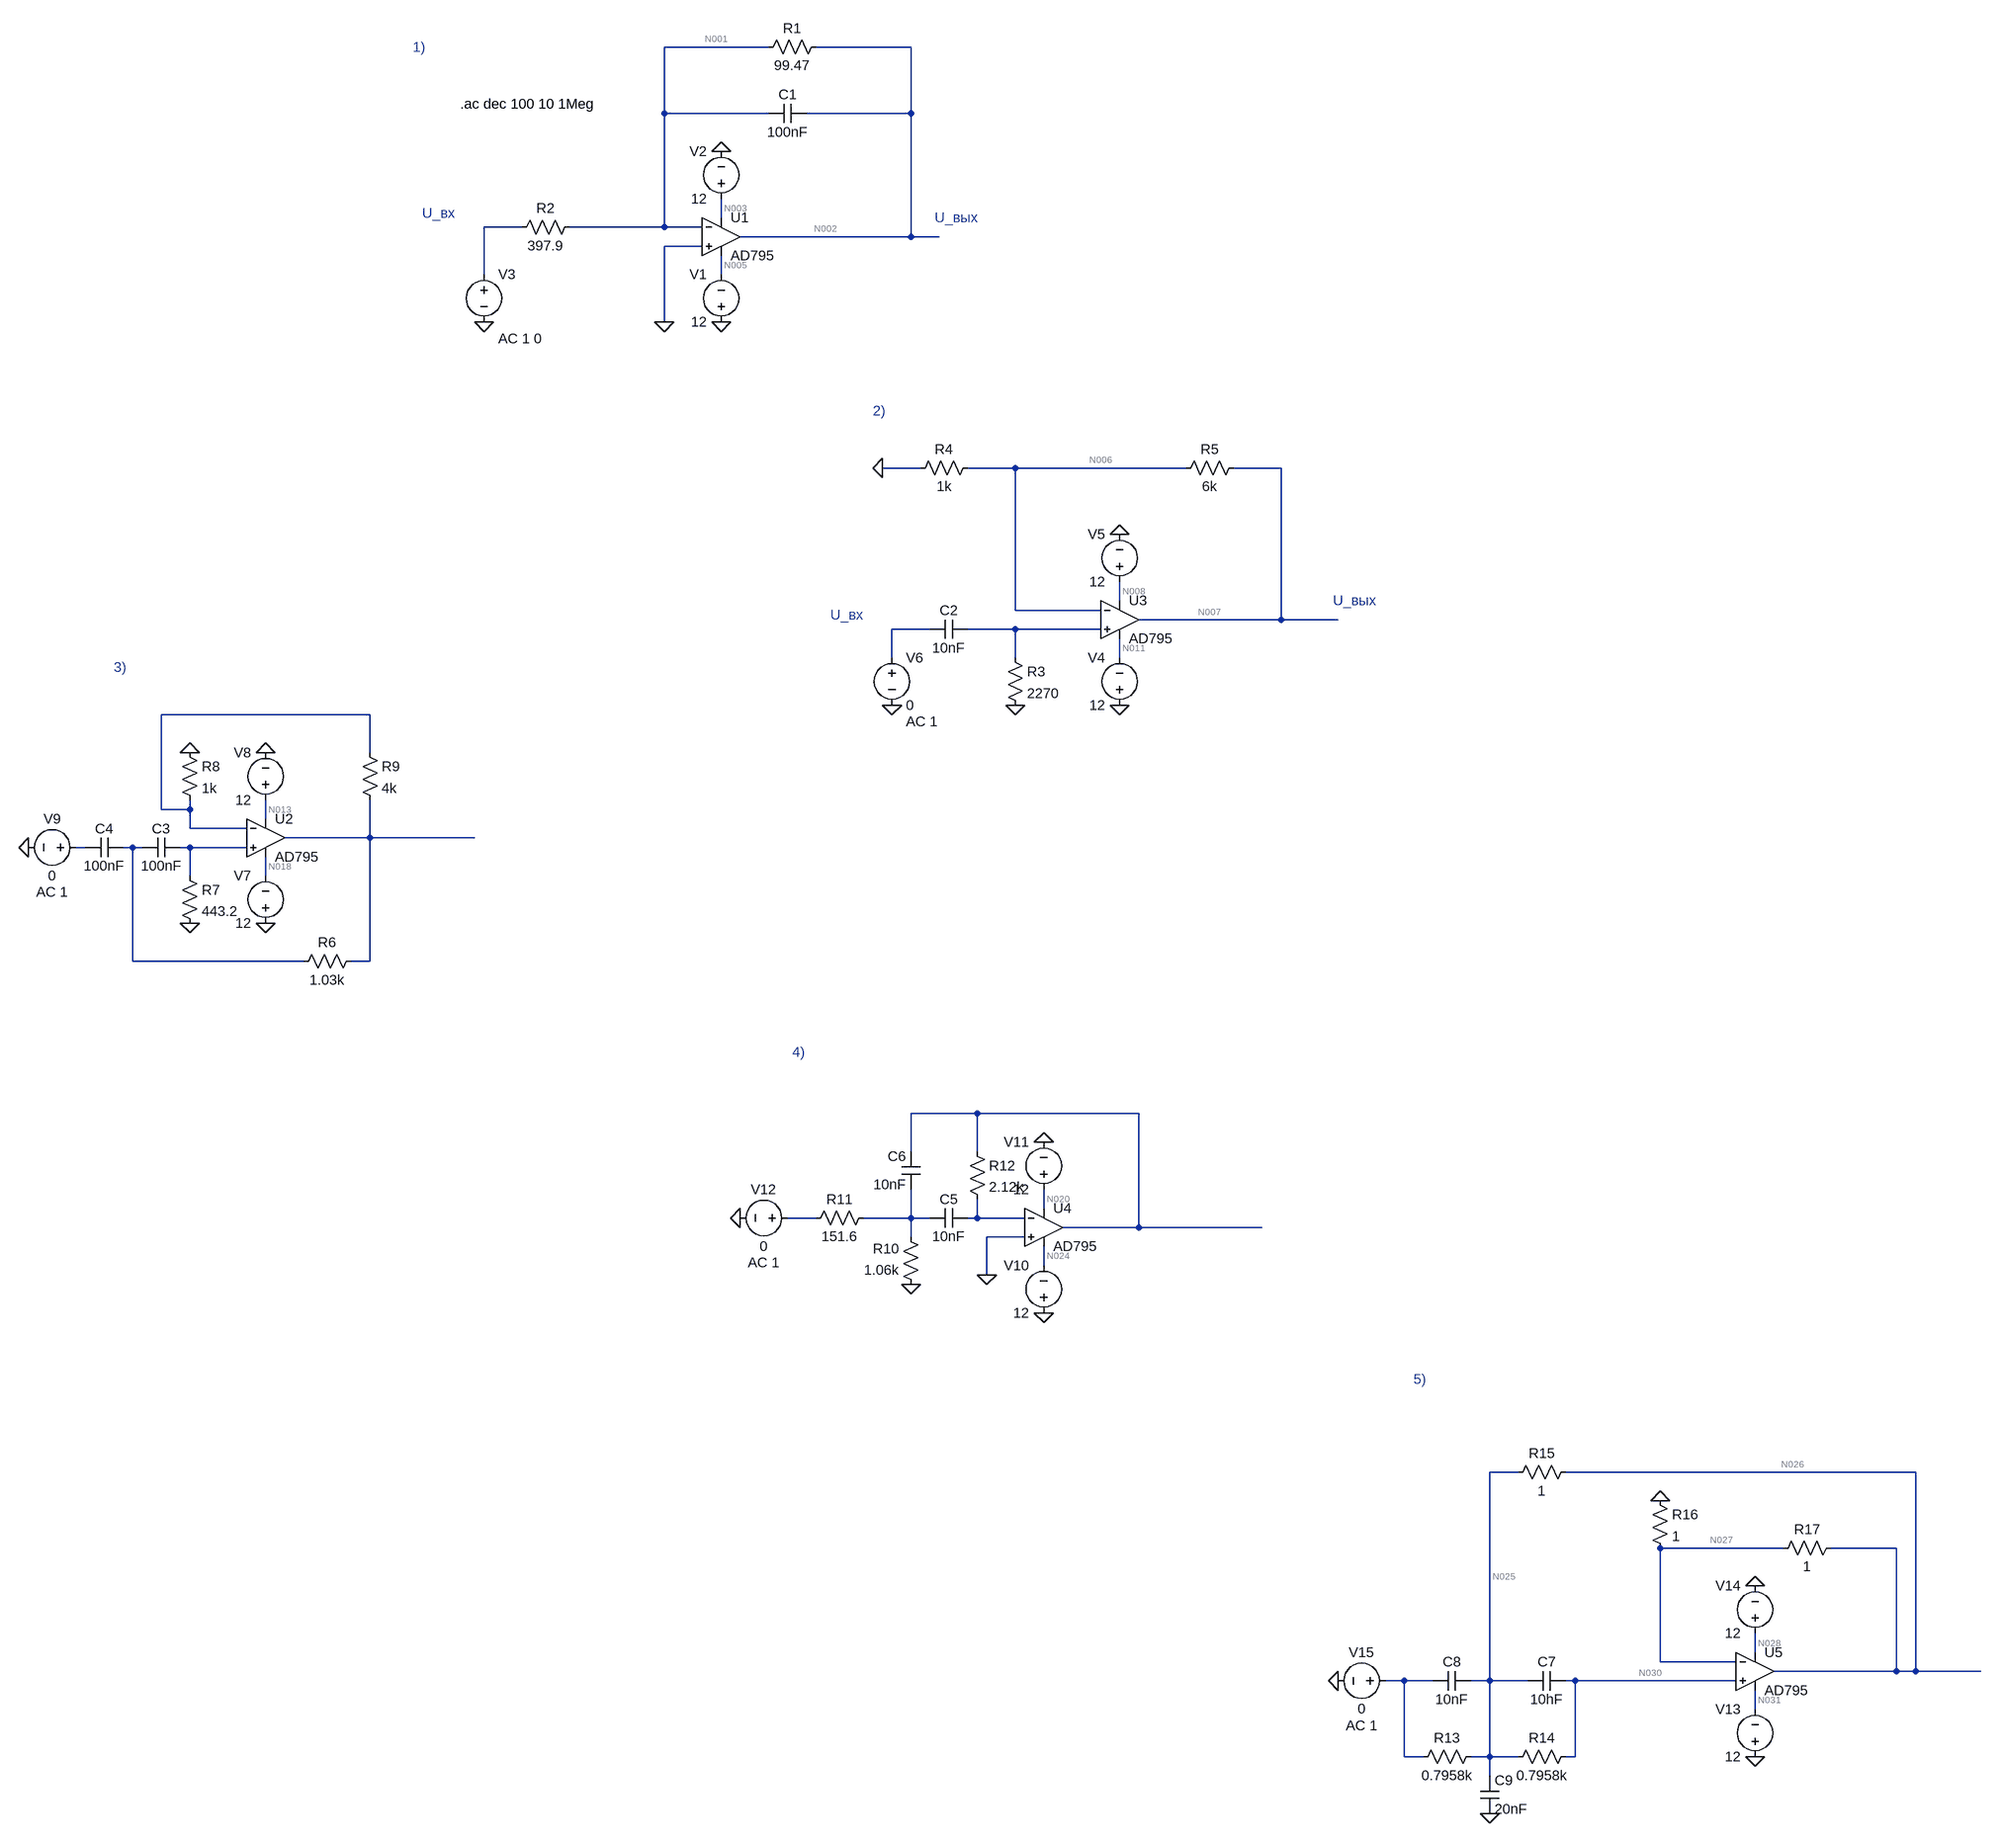
[diagram p0: schematic all.asc]
all.asc, the LTspice schematic file:
Version 4.1
SHEET 1 2724 3428
WIRE 352 -160 176 -160
WIRE 592 -160 432 -160
WIRE 176 -48 176 -160
WIRE 352 -48 176 -48
WIRE 592 -48 592 -160
WIRE 592 -48 416 -48
WIRE 272 128 272 96
WIRE -64 144 -128 144
WIRE 176 144 176 -48
WIRE 176 144 16 144
WIRE 240 144 176 144
WIRE 592 160 592 -48
WIRE 592 160 304 160
WIRE 640 160 592 160
WIRE 240 176 176 176
WIRE -128 224 -128 144
WIRE 272 224 272 192
WIRE 176 304 176 176
WIRE 608 640 544 640
WIRE 768 640 688 640
WIRE 1056 640 768 640
WIRE 1216 640 1136 640
WIRE 944 864 944 832
WIRE 768 880 768 640
WIRE 912 880 768 880
WIRE 1216 896 1216 640
WIRE 1216 896 976 896
WIRE 1312 896 1216 896
WIRE 624 912 560 912
WIRE 768 912 688 912
WIRE 912 912 768 912
WIRE 560 960 560 912
WIRE 768 960 768 912
WIRE 944 960 944 928
WIRE -320 1056 -672 1056
WIRE -320 1120 -320 1056
WIRE -672 1216 -672 1056
WIRE -624 1216 -624 1200
WIRE -624 1216 -672 1216
WIRE -496 1232 -496 1200
WIRE -624 1248 -624 1216
WIRE -528 1248 -624 1248
WIRE -320 1264 -320 1200
WIRE -320 1264 -464 1264
WIRE -144 1264 -320 1264
WIRE -800 1280 -816 1280
WIRE -720 1280 -736 1280
WIRE -704 1280 -720 1280
WIRE -624 1280 -640 1280
WIRE -528 1280 -624 1280
WIRE -624 1328 -624 1280
WIRE -496 1328 -496 1296
WIRE -720 1472 -720 1280
WIRE -432 1472 -720 1472
WIRE -320 1472 -320 1264
WIRE -320 1472 -352 1472
WIRE 704 2224 592 2224
WIRE 976 2224 704 2224
WIRE 592 2288 592 2224
WIRE 704 2288 704 2224
WIRE 816 2384 816 2352
WIRE 432 2400 384 2400
WIRE 592 2400 592 2352
WIRE 592 2400 512 2400
WIRE 624 2400 592 2400
WIRE 704 2400 704 2368
WIRE 704 2400 688 2400
WIRE 784 2400 704 2400
WIRE 976 2416 976 2224
WIRE 976 2416 848 2416
WIRE 1184 2416 976 2416
WIRE 592 2432 592 2400
WIRE 784 2432 720 2432
WIRE 816 2480 816 2448
WIRE 720 2496 720 2432
WIRE 1616 2832 1568 2832
WIRE 2496 2832 1696 2832
WIRE 2080 2960 1872 2960
WIRE 2464 2960 2160 2960
WIRE 2032 3136 2032 3104
WIRE 1872 3152 1872 2960
WIRE 2000 3152 1872 3152
WIRE 2464 3168 2464 2960
WIRE 2464 3168 2064 3168
WIRE 2496 3168 2496 2832
WIRE 2496 3168 2464 3168
WIRE 2720 3168 2496 3168
WIRE 1424 3184 1392 3184
WIRE 1472 3184 1424 3184
WIRE 1568 3184 1568 2832
WIRE 1568 3184 1536 3184
WIRE 1632 3184 1568 3184
WIRE 1712 3184 1696 3184
WIRE 2000 3184 1712 3184
WIRE 2032 3232 2032 3200
WIRE 1424 3312 1424 3184
WIRE 1456 3312 1424 3312
WIRE 1568 3312 1568 3184
WIRE 1568 3312 1536 3312
WIRE 1616 3312 1568 3312
WIRE 1712 3312 1712 3184
WIRE 1712 3312 1696 3312
WIRE 1568 3344 1568 3312
FLAG 272 16 0
FLAG 272 304 0
FLAG 176 304 0
FLAG -128 304 0
FLAG 944 752 0
FLAG 944 1040 0
FLAG 768 1040 0
FLAG 560 1040 0
FLAG 544 640 0
FLAG -496 1120 0
FLAG -496 1408 0
FLAG -896 1280 0
FLAG -624 1408 0
FLAG -624 1120 0
FLAG 720 2496 0
FLAG 816 2272 0
FLAG 816 2560 0
FLAG 592 2512 0
FLAG 304 2400 0
FLAG 2032 3024 0
FLAG 2032 3312 0
FLAG 1568 3408 0
FLAG 1872 2880 0
FLAG 1312 3184 0
SYMBOL OpAmps\\AD795 272 96 R0
SYMATTR InstName U1
SYMBOL voltage 272 320 R180
WINDOW 0 24 96 Left 2
WINDOW 3 24 16 Left 2
SYMATTR InstName V1
SYMATTR Value 12
SYMBOL voltage 272 112 R180
WINDOW 0 24 96 Left 2
WINDOW 3 24 16 Left 2
SYMATTR InstName V2
SYMATTR Value 12
SYMBOL res 448 -176 R90
WINDOW 0 0 56 VBottom 2
WINDOW 3 32 56 VTop 2
SYMATTR InstName R1
SYMATTR Value 99.47
SYMBOL res 32 128 R90
WINDOW 0 0 56 VBottom 2
WINDOW 3 32 56 VTop 2
SYMATTR InstName R2
SYMATTR Value 397.9
SYMBOL cap 416 -64 R90
WINDOW 0 0 32 VBottom 2
WINDOW 3 32 32 VTop 2
SYMATTR InstName C1
SYMATTR Value 100nF
SYMBOL OpAmps\\AD795 944 832 R0
SYMATTR InstName U3
SYMBOL voltage 944 1056 R180
WINDOW 0 24 96 Left 2
WINDOW 3 24 16 Left 2
SYMATTR InstName V4
SYMATTR Value 12
SYMBOL voltage 944 848 R180
WINDOW 0 24 96 Left 2
WINDOW 3 24 16 Left 2
SYMATTR InstName V5
SYMATTR Value 12
SYMBOL res 704 624 R90
WINDOW 0 0 56 VBottom 2
WINDOW 3 32 56 VTop 2
SYMATTR InstName R4
SYMATTR Value 1k
SYMBOL res 1152 624 R90
WINDOW 0 0 56 VBottom 2
WINDOW 3 32 56 VTop 2
SYMATTR InstName R5
SYMATTR Value 6k
SYMBOL cap 688 896 R90
WINDOW 0 0 32 VBottom 2
WINDOW 3 32 32 VTop 2
SYMATTR InstName C2
SYMATTR Value 10nF
SYMBOL voltage 560 944 R0
WINDOW 123 24 124 Left 2
WINDOW 39 0 0 Left 0
SYMATTR Value2 AC 1
SYMATTR InstName V6
SYMATTR Value 0
SYMBOL res 752 944 R0
SYMATTR InstName R3
SYMATTR Value 2270
SYMBOL OpAmps\\AD795 -496 1200 R0
SYMATTR InstName U2
SYMBOL voltage -496 1424 R180
WINDOW 0 24 96 Left 2
WINDOW 3 24 16 Left 2
SYMATTR InstName V7
SYMATTR Value 12
SYMBOL voltage -496 1216 R180
WINDOW 0 24 96 Left 2
WINDOW 3 24 16 Left 2
SYMATTR InstName V8
SYMATTR Value 12
SYMBOL cap -640 1264 R90
WINDOW 0 0 32 VBottom 2
WINDOW 3 32 32 VTop 2
SYMATTR InstName C3
SYMATTR Value 100nF
SYMBOL cap -736 1264 R90
WINDOW 0 0 32 VBottom 2
WINDOW 3 32 32 VTop 2
SYMATTR InstName C4
SYMATTR Value 100nF
SYMBOL voltage -800 1280 R90
WINDOW 0 -32 56 VBottom 2
WINDOW 3 32 56 VTop 2
WINDOW 123 60 56 VTop 2
WINDOW 39 0 0 Left 0
SYMATTR InstName V9
SYMATTR Value 0
SYMATTR Value2 AC 1
SYMBOL res -336 1456 R90
WINDOW 0 0 56 VBottom 2
WINDOW 3 32 56 VTop 2
SYMATTR InstName R6
SYMATTR Value 1.03k
SYMBOL res -640 1312 R0
SYMATTR InstName R7
SYMATTR Value 443.2
SYMBOL res -640 1104 R0
SYMATTR InstName R8
SYMATTR Value 1k
SYMBOL res -336 1104 R0
SYMATTR InstName R9
SYMATTR Value 4k
SYMBOL OpAmps\\AD795 816 2352 R0
SYMATTR InstName U4
SYMBOL voltage 816 2576 R180
WINDOW 0 24 96 Left 2
WINDOW 3 24 16 Left 2
SYMATTR InstName V10
SYMATTR Value 12
SYMBOL voltage 816 2368 R180
WINDOW 0 24 96 Left 2
WINDOW 3 24 16 Left 2
SYMATTR InstName V11
SYMATTR Value 12
SYMBOL cap 688 2384 R90
WINDOW 0 0 32 VBottom 2
WINDOW 3 32 32 VTop 2
SYMATTR InstName C5
SYMATTR Value 10nF
SYMBOL res 608 2528 R180
WINDOW 0 36 76 Left 2
WINDOW 3 36 40 Left 2
SYMATTR InstName R10
SYMATTR Value 1.06k
SYMBOL res 528 2384 R90
WINDOW 0 0 56 VBottom 2
WINDOW 3 32 56 VTop 2
SYMATTR InstName R11
SYMATTR Value 151.6
SYMBOL voltage 400 2400 R90
WINDOW 0 -32 56 VBottom 2
WINDOW 3 32 56 VTop 2
WINDOW 123 60 56 VTop 2
WINDOW 39 0 0 Left 0
SYMATTR InstName V12
SYMATTR Value 0
SYMATTR Value2 AC 1
SYMBOL cap 608 2352 R180
WINDOW 0 24 56 Left 2
WINDOW 3 24 8 Left 2
SYMATTR InstName C6
SYMATTR Value 10nF
SYMBOL res 688 2272 R0
SYMATTR InstName R12
SYMATTR Value 2.12k
SYMBOL OpAmps\\AD795 2032 3104 R0
SYMATTR InstName U5
SYMBOL voltage 2032 3328 R180
WINDOW 0 24 96 Left 2
WINDOW 3 24 16 Left 2
SYMATTR InstName V13
SYMATTR Value 12
SYMBOL voltage 2032 3120 R180
WINDOW 0 24 96 Left 2
WINDOW 3 24 16 Left 2
SYMATTR InstName V14
SYMATTR Value 12
SYMBOL cap 1696 3168 R90
WINDOW 0 0 32 VBottom 2
WINDOW 3 32 32 VTop 2
SYMATTR InstName C7
SYMATTR Value 10hF
SYMBOL cap 1536 3168 R90
WINDOW 0 0 32 VBottom 2
WINDOW 3 32 32 VTop 2
SYMATTR InstName C8
SYMATTR Value 10nF
SYMBOL res 1552 3296 R90
WINDOW 0 0 56 VBottom 2
WINDOW 3 32 56 VTop 2
SYMATTR InstName R13
SYMATTR Value 0.7958k
SYMBOL res 1712 3296 R90
WINDOW 0 0 56 VBottom 2
WINDOW 3 32 56 VTop 2
SYMATTR InstName R14
SYMATTR Value 0.7958k
SYMBOL cap 1552 3344 R0
SYMATTR InstName C9
SYMATTR Value 20nF
SYMBOL voltage 1408 3184 R90
WINDOW 0 -32 56 VBottom 2
WINDOW 3 32 56 VTop 2
WINDOW 123 60 56 VTop 2
WINDOW 39 0 0 Left 0
SYMATTR InstName V15
SYMATTR Value 0
SYMATTR Value2 AC 1
SYMBOL res 1712 2816 R90
WINDOW 0 0 56 VBottom 2
WINDOW 3 32 56 VTop 2
SYMATTR InstName R15
SYMATTR Value 1
SYMBOL res 1856 2864 R0
SYMATTR InstName R16
SYMATTR Value 1
SYMBOL res 2176 2944 R90
WINDOW 0 0 56 VBottom 2
WINDOW 3 32 56 VTop 2
SYMATTR InstName R17
SYMATTR Value 1
SYMBOL voltage -128 208 R0
WINDOW 123 24 124 Left 2
WINDOW 39 0 0 Left 0
SYMATTR InstName V3
SYMATTR Value ""
SYMATTR Value2 AC 1 0
TEXT 632 128 Left 2 ;U_вых
TEXT -232 120 Left 2 ;U_вх
TEXT 1304 864 Left 2 ;U_вых
TEXT 456 888 Left 2 ;U_вх
TEXT -168 -64 Left 2 !.ac dec 100 10 1Meg
TEXT -248 -160 Left 2 ;1)
TEXT 528 544 Left 2 ;2)
TEXT -752 976 Left 2 ;3)
TEXT 392 2120 Left 2 ;4)
TEXT 1440 2672 Left 2 ;5)

The netlist it stands for:
* all.asc
X§U1 0 N001 N003 N005 N002 AD795  ; pins In+ In- V+ V- OUT
V1 0 N005 12
V2 N003 0 12
R1 N002 N001 99.47
R2 N001 N004 397.9
C1 N002 N001 100nF
X§U3 N010 N006 N008 N011 N007 AD795  ; pins In+ In- V+ V- OUT
V4 0 N011 12
V5 N008 0 12
R4 N006 0 1k
R5 N007 N006 6k
C2 N010 N009 10nF
V6 N009 0 0 AC 1
R3 N010 0 2270
X§U2 N017 N012 N013 N018 N014 AD795  ; pins In+ In- V+ V- OUT
V7 0 N018 12
V8 N013 0 12
C3 N017 N016 100nF
C4 N016 N015 100nF
V9 N015 0 0 AC 1
R6 N014 N016 1.03k
R7 N017 0 443.2
R8 0 N012 1k
R9 N012 N014 4k
X§U4 0 N023 N020 N024 N019 AD795  ; pins In+ In- V+ V- OUT
V10 0 N024 12
V11 N020 0 12
C5 N023 N022 10nF
R10 0 N022 1.06k
R11 N022 N021 151.6
V12 N021 0 0 AC 1
C6 N022 N019 10nF
R12 N019 N023 2.12k
X§U5 N030 N027 N028 N031 N026 AD795  ; pins In+ In- V+ V- OUT
V13 0 N031 12
V14 N028 0 12
C7 N030 N025 10hF
C8 N025 N029 10nF
R13 N025 N029 0.7958k
R14 N030 N025 0.7958k
C9 N025 0 20nF
V15 N029 0 0 AC 1
R15 N026 N025 1
R16 0 N027 1
R17 N026 N027 1
V3 N004 0 AC 1 0
* U_вых
* U_вх
* U_вых
* U_вх
.ac dec 100 10 1Meg
* 1)
* 2)
* 3)
* 4)
* 5)
.lib ADI1.lib
.backanno
.end

* Results of the author's LTspice run, read from the files saved beside the schematic
* Operating Point, zero values left out:
*   V(n003) = 12 V
*   V(n005) = -12 V
*   V(n008) = 12 V
*   V(n011) = -12 V
*   V(n013) = 12 V
*   V(n018) = -12 V
*   V(n020) = 12 V
*   V(n024) = -12 V
*   V(n025) = -30.08 mV
*   V(n026) = -30.12 mV
*   V(n027) = -15.06 mV
*   V(n028) = 12 V
*   V(n030) = -30.08 mV
*   V(n031) = -12 V
*   I(R13) = -37.8 µA
*   I(R15) = -37.8 µA
*   I(R16) = 15.06 mA
*   I(R17) = -15.06 mA
*   I(V1) = -1.226 mA
*   I(V10) = -1.226 mA
*   I(V11) = -1.226 mA
*   I(V13) = -16.1 mA
*   I(V14) = -1 mA
*   I(V15) = -37.8 µA
*   I(V2) = -1.226 mA
*   I(V4) = -1.226 mA
*   I(V5) = -1.226 mA
*   I(V7) = -1.226 mA
*   I(V8) = -1.226 mA
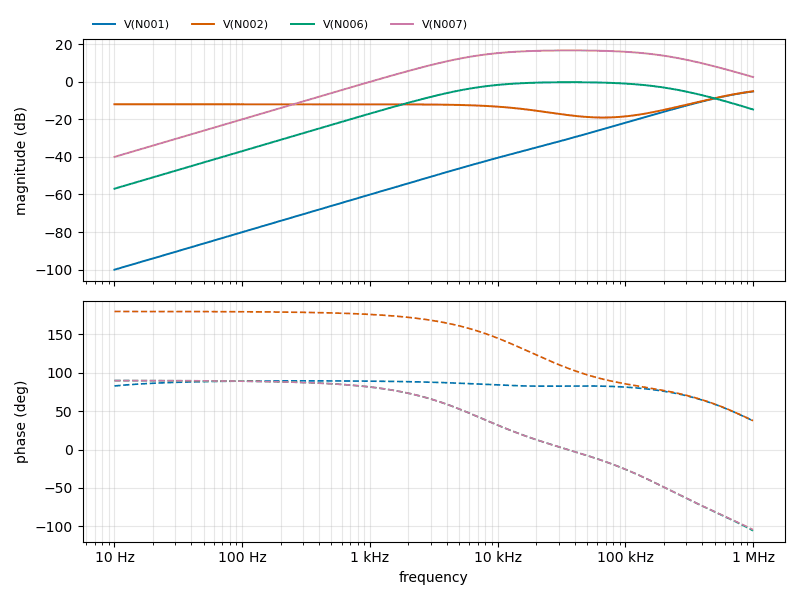
[diagram p1: AC Analysis of all.asc, plotted from the saved traces]
* AC Analysis, 1 run:
*   V(N001): -99.97 dB at 10 Hz, -5.19 dB at 1 MHz, peak -5.19 dB at 1 MHz, 3 dB below the peak at 560.6 kHz
*   V(N002): -12.04 dB at 10 Hz, -5.15 dB at 1 MHz, peak -5.15 dB at 1 MHz, 3 dB below the peak at 552.3 kHz
*   V(N006): -56.92 dB at 10 Hz, -14.81 dB at 1 MHz, peak -0.31 dB at 37.15 kHz, 3 dB below the peak at 6.555 kHz and 208.1 kHz
*   V(N007): -40.01 dB at 10 Hz, 2.44 dB at 1 MHz, peak 16.59 dB at 37.15 kHz, 3 dB below the peak at 6.556 kHz and 208.8 kHz